# Altium schematic sheet flash.SchDoc
size A3
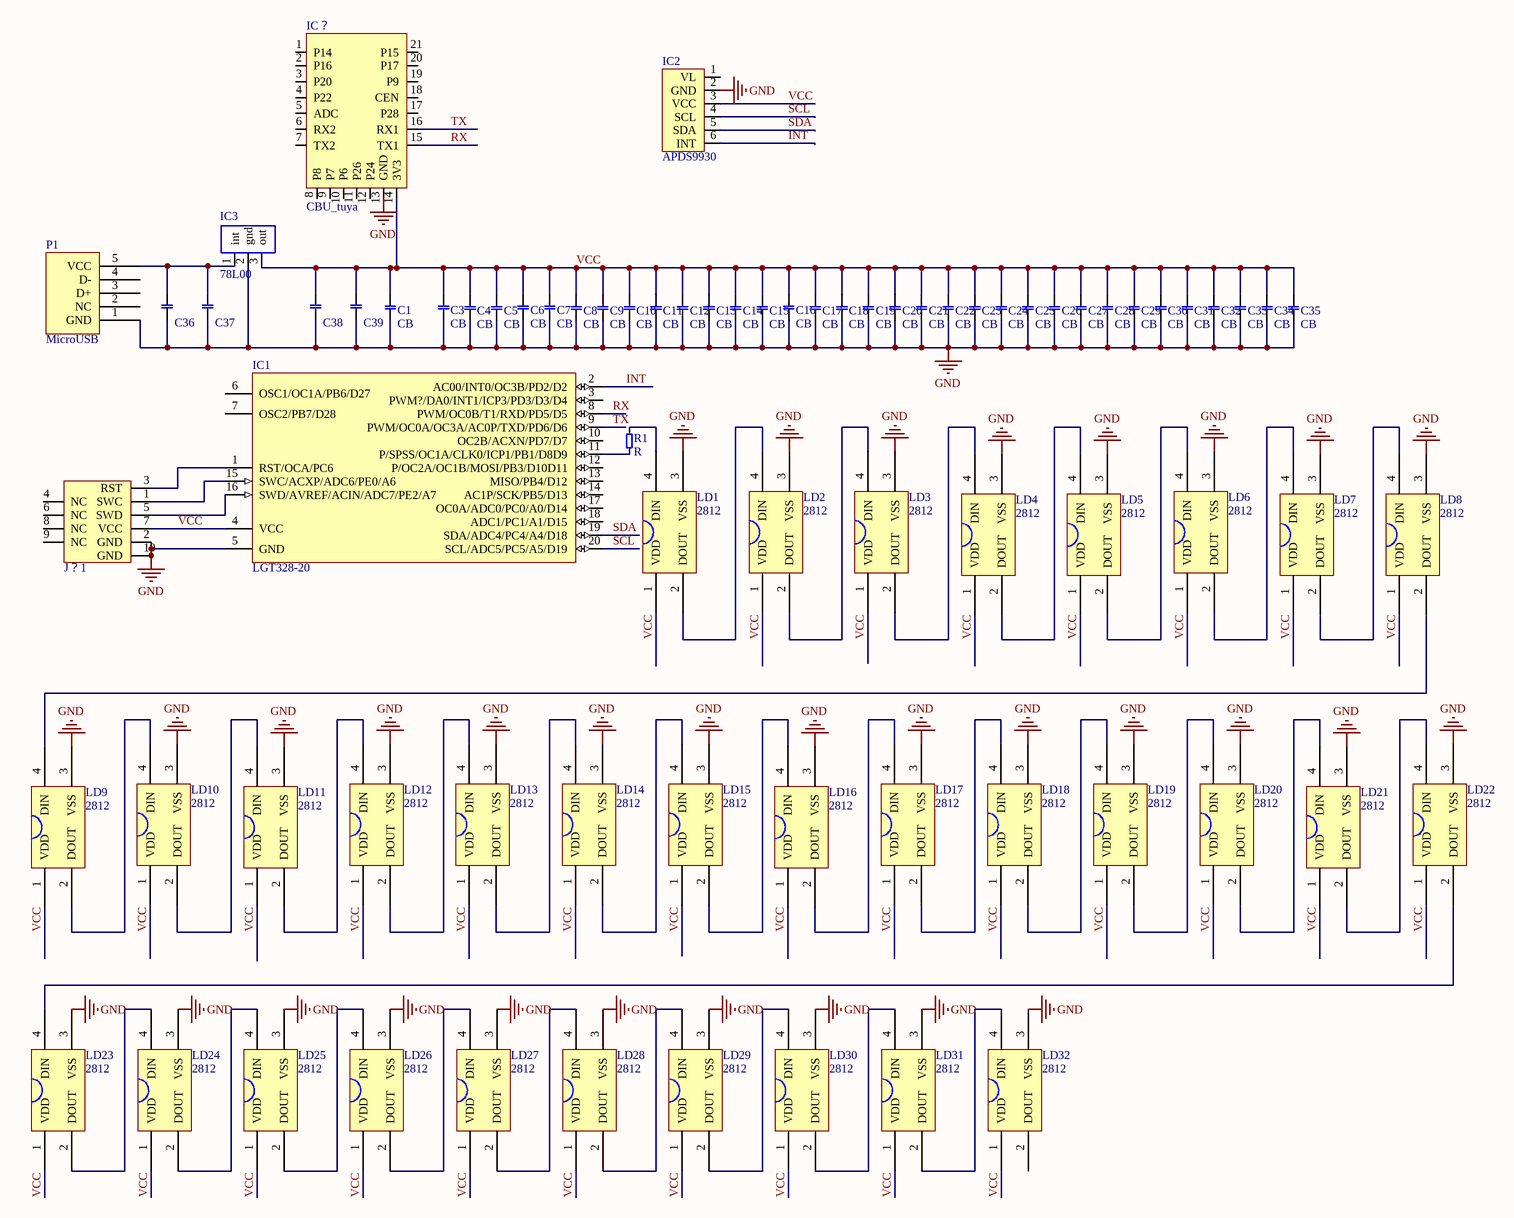
[diagram p0: flash.SchDoc]

## Parts
C1  CB  [1206]
C3  CB  [0805]
C4  CB  [0805]
C5  CB  [0805]
C6  CB  [0805]
C7  CB  [0805]
C8  CB  [0805]
C9  CB  [0805]
C10  CB  [0805]
C11  CB  [0805]
C12  CB  [0805]
C13  CB  [0805]
C14  CB  [0805]
C15  CB  [0805]
C16  CB  [0805]
C17  CB  [0805]
C18  CB  [0805]
C19  CB  [0805]
C20  CB  [0805]
C21  CB  [0805]
C22  CB  [0805]
C23  CB  [0805]
C24  CB  [0805]
C25  CB  [0805]
C26  CB  [0805]
C27  CB  [0805]
C28  CB  [0805]
C29  CB  [0805]
C30  CB  [0805]
C31  CB  [0805]
C32  CB  [0805]
C33  CB  [0805]
C34  CB  [0805]
C35  CB  [0805]
C36  CB  [1206]  (value not drawn)
C37  CB  [0805]  (value not drawn)
C38  CB  [0805]  (value not drawn)
C39  CB  [0805]  (value not drawn)
IC1  LGT328-20  [LGT328-20]
IC2  APDS9930  [APDS9930]
IC3  78L00  [SOT223]
IC？  CBU_tuya  [CBU_tuya]
J？1  LGTDOWN  [LGTDoWN-10]  (value not drawn)
LD1  2812  [WS2812]
LD2  2812  [WS2812]
LD3  2812  [WS2812]
LD4  2812  [WS2812]
LD5  2812  [WS2812]
LD6  2812  [WS2812]
LD7  2812  [WS2812]
LD8  2812  [WS2812]
LD9  2812  [WS2812]
LD10  2812  [WS2812]
LD11  2812  [WS2812]
LD12  2812  [WS2812]
LD13  2812  [WS2812]
LD14  2812  [WS2812]
LD15  2812  [WS2812]
LD16  2812  [WS2812]
LD17  2812  [WS2812]
LD18  2812  [WS2812]
LD19  2812  [WS2812]
LD20  2812  [WS2812]
LD21  2812  [WS2812]
LD22  2812  [WS2812]
LD23  2812  [WS2812]
LD24  2812  [WS2812]
LD25  2812  [WS2812]
LD26  2812  [WS2812]
LD27  2812  [WS2812]
LD28  2812  [WS2812]
LD29  2812  [WS2812]
LD30  2812  [WS2812]
LD31  2812  [WS2812]
LD32  2812  [WS2812]
P1  MicroUSB  [MicroUSB]
R1  R  [0805]

## Nets
GND: C1.2 C3.2 C4.2 C5.2 C6.2 C7.2 C8.2 C9.2 C10.2 C11.2 C12.2 C13.2 C14.2 C15.2 C16.2 C17.2 C18.2 C19.2 C20.2 C21.2 C22.2 C23.2 C24.2 C25.2 C26.2 C27.2 C28.2 C29.2 C30.2 C31.2 C32.2 C33.2 C34.2 C35.2 C36.2 C37.2 C38.2 C39.2 IC1.5(GND) IC2.2(GND) IC3.2(gnd) IC？.13(GND) J？1.2(GND) J？1.10(GND) LD1.3(VSS) LD2.3(VSS) LD3.3(VSS) LD4.3(VSS) LD5.3(VSS) LD6.3(VSS) LD7.3(VSS) LD8.3(VSS) LD9.3(VSS) LD10.3(VSS) LD11.3(VSS) LD12.3(VSS) LD13.3(VSS) LD14.3(VSS) LD15.3(VSS) LD16.3(VSS) LD17.3(VSS) LD18.3(VSS) LD19.3(VSS) LD20.3(VSS) LD21.3(VSS) LD22.3(VSS) LD23.3(VSS) LD24.3(VSS) LD25.3(VSS) LD26.3(VSS) LD27.3(VSS) LD28.3(VSS) LD29.3(VSS) LD30.3(VSS) LD31.3(VSS) LD32.3(VSS) P1.1(GND)
INT: IC1.2(AC00/INT0/OC3B/PD2/D2) IC2.6(INT)
RX: IC1.8(PWM/OC0B/T1/RXD/PD5/D5) IC？.15(TX1)
SCL: IC1.20(SCL/ADC5/PC5/A5/D19) IC2.4(SCL)
SDA: IC1.19(SDA/ADC4/PC4/A4/D18) IC2.5(SDA)
TX: IC1.9(PWM/OC0A/OC3A/AC0P/TXD/PD6/D6) IC？.16(RX1)
VCC: C1.1 C3.1 C4.1 C5.1 C6.1 C7.1 C8.1 C9.1 C10.1 C11.1 C12.1 C13.1 C14.1 C15.1 C16.1 C17.1 C18.1 C19.1 C20.1 C21.1 C22.1 C23.1 C24.1 C25.1 C26.1 C27.1 C28.1 C29.1 C30.1 C31.1 C32.1 C33.1 C34.1 C35.1 C38.1 C39.1 IC1.4(VCC) IC2.3(VCC) IC3.3(out) IC？.14(3V3) J？1.7(VCC) LD1.1(VDD) LD2.1(VDD) LD3.1(VDD) LD4.1(VDD) LD5.1(VDD) LD6.1(VDD) LD7.1(VDD) LD8.1(VDD) LD9.1(VDD) LD10.1(VDD) LD11.1(VDD) LD12.1(VDD) LD13.1(VDD) LD14.1(VDD) LD15.1(VDD) LD16.1(VDD) LD17.1(VDD) LD18.1(VDD) LD19.1(VDD) LD20.1(VDD) LD21.1(VDD) LD22.1(VDD) LD23.1(VDD) LD24.1(VDD) LD25.1(VDD) LD26.1(VDD) LD27.1(VDD) LD28.1(VDD) LD29.1(VDD) LD30.1(VDD) LD31.1(VDD) LD32.1(VDD)
NetC36_1: C36.1 C37.1 IC3.1(int) P1.5(VCC)
NetIC1_1: IC1.1(RST/OCA/PC6) J？1.3(RST)
NetIC1_11: IC1.11(P/SPSS/OC1A/CLK0/ICP1/PB1/D8D9) R1.1
NetIC1_15: IC1.15(SWC/ACXP/ADC6/PE0/A6) J？1.1(SWC)
NetIC1_16: IC1.16(SWD/AVREF/ACIN/ADC7/PE2/A7) J？1.5(SWD)
NetLD1_2: LD1.2(DOUT) LD2.4(DIN)
NetLD1_4: LD1.4(DIN) R1.2
NetLD2_2: LD2.2(DOUT) LD3.4(DIN)
NetLD3_2: LD3.2(DOUT) LD4.4(DIN)
NetLD4_2: LD4.2(DOUT) LD5.4(DIN)
NetLD5_2: LD5.2(DOUT) LD6.4(DIN)
NetLD6_2: LD6.2(DOUT) LD7.4(DIN)
NetLD7_2: LD7.2(DOUT) LD8.4(DIN)
NetLD8_2: LD8.2(DOUT) LD9.4(DIN)
NetLD9_2: LD9.2(DOUT) LD10.4(DIN)
NetLD10_2: LD10.2(DOUT) LD11.4(DIN)
NetLD11_2: LD11.2(DOUT) LD12.4(DIN)
NetLD12_2: LD12.2(DOUT) LD13.4(DIN)
NetLD13_2: LD13.2(DOUT) LD14.4(DIN)
NetLD14_2: LD14.2(DOUT) LD15.4(DIN)
NetLD15_2: LD15.2(DOUT) LD16.4(DIN)
NetLD16_2: LD16.2(DOUT) LD17.4(DIN)
NetLD17_2: LD17.2(DOUT) LD18.4(DIN)
NetLD18_2: LD18.2(DOUT) LD19.4(DIN)
NetLD19_2: LD19.2(DOUT) LD20.4(DIN)
NetLD20_2: LD20.2(DOUT) LD21.4(DIN)
NetLD21_2: LD21.2(DOUT) LD22.4(DIN)
NetLD22_2: LD22.2(DOUT) LD23.4(DIN)
NetLD23_2: LD23.2(DOUT) LD24.4(DIN)
NetLD24_2: LD24.2(DOUT) LD25.4(DIN)
NetLD25_2: LD25.2(DOUT) LD26.4(DIN)
NetLD26_2: LD26.2(DOUT) LD27.4(DIN)
NetLD27_2: LD27.2(DOUT) LD28.4(DIN)
NetLD28_2: LD28.2(DOUT) LD29.4(DIN)
NetLD29_2: LD29.2(DOUT) LD30.4(DIN)
NetLD30_2: LD30.2(DOUT) LD31.4(DIN)
NetLD31_2: LD31.2(DOUT) LD32.4(DIN)

Not connected (* = marked no-connect by the designer): IC1 3(PWM?/DA0/INT1/ICP3/PD3/D3/D4) 6(OSC1/OC1A/PB6/D27) 7(OSC2/PB7/D28) 10(OC2B/ACXN/PD7/D7) 12(P/OC2A/OC1B/MOSI/PB3/D10D11) 13(MISO/PB4/D12) 14(AC1P/SCK/PB5/D13) 17(OC0A/ADC0/PC0/A0/D14) 18(ADC1/PC1/A1/D15); IC2 1(VL); IC？ 1(P14) 2(P16) 3(P20) 4(P22) 5(ADC) 6(RX2) 7(TX2) 8(P8) 9(P7) 10(P6) 11(P26) 12(P24) 17(P28) 18(CEN) 19(P9) 20(P17) 21(P15); J？1 4(NC) 6(NC) 8(NC) 9(NC); LD32 2(DOUT); P1 2(NC) 3(D+) 4(D-)

## Notes on the sheet
- Title
- Size:
- Date:
- A3
- Number:
- Time:
- Revision:
- Sheet
- of
- File:

## Library data of the parts
J？1 = LGTDOWN-10
LD1-LD32 = ws2812